# Altium schematic sheet power_sys_sch.SchDoc
size A; SheetNumber: 1; SheetTotal: 1
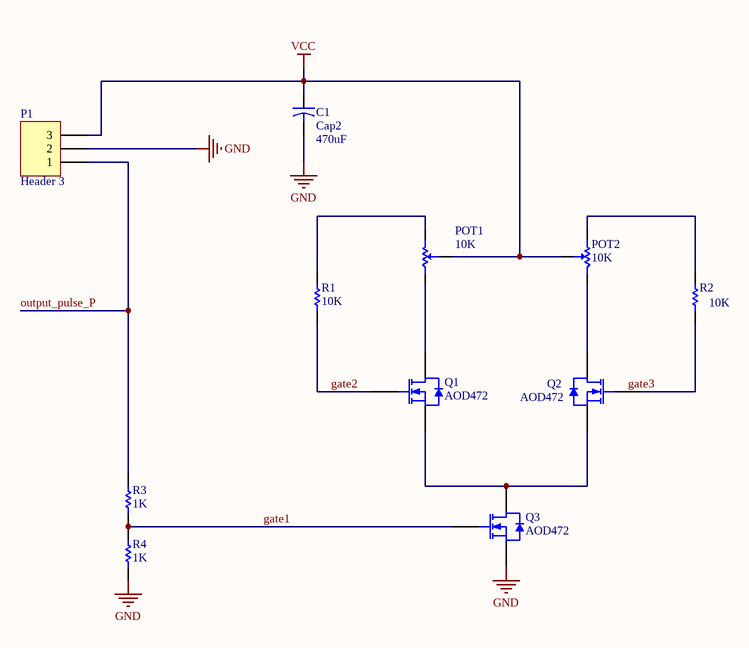
[diagram p0: power_sys_sch.SchDoc]

## Parts
C1  Cap2  value 470uF  [CAPR5-4X5]
P1  Header 3  [HDR1X3]
POT1  10K  [POT]
POT2  10K  [POT]
Q1  AOD472  [TO252-3L]
Q2  AOD472  [TO252-3L]
Q3  AOD472  [TO252-3L]
R1  10K  [RESC4817X04N]
R2  10K  [RESC4817X04N]
R3  1K  [RESC4817X04N]
R4  1K  [RESC4817X04N]

## Nets
GND: C1.2 P1.2 Q3.3(S) R4.1
VCC: C1.1 P1.3 POT1.3(SetPoint) POT2.3(SetPoint)
gate1: Q3.1(G) R3.1 R4.2
gate2: Q1.1(G) R1.1
output_pulse_P: P1.1 R3.2
NetPOT1_1: POT1.1(CCW) Q1.4(D)
NetPOT1_2: POT1.2(CW) R1.2
NetPOT2_1: POT2.1(CCW) Q2.4(D)
NetPOT2_2: POT2.2(CW) R2.2
NetQ1_3: Q1.3(S) Q2.3(S) Q3.4(D)
NetQ2_1: Q2.1(G) R2.1

## Notes on the sheet
- Labels drawn without touching a wire or pin: gate3

## Library data of the parts
C1 = Cap2: Capacitor; Published: 23-Sep-2002; PackageReference: CAPR5-4X5; Publisher: Altium Limited; PackageDescription: Capacitor; 2 Leads
P1 = Header 3: Header, 3-Pin; System: Connector; LatestRevisionDate: 17-Jul-2002; LatestRevisionNote: Re-released for DXP Platform.; Publisher: Altium Limited
POT1 POT2 = POT: Variable Resistor; Value: 10K
Q1-Q3 = AOD472: N-channel MOSFET; Note: Pin 2 is trimmed (and not drawn) and is electrically connected to Drain; Published: 2017-1-12; DatasheetVersion: 2017-1-12; PackageVersion: 2017-1-12; PackageReference: D-PAK TO-252; Publisher: Abbas Basereh; PackageDescription: D-PAK TO-252; ComponentLink1Description: Manufacturer Link; ComponentLink2Description: Datasheet; ComponentLink2URL: http://www.roboeq.ir/files/id/2912/name/aod472.pdf/
R1-R4 = RES 1206 0.25W: RES 1206; Designer: Abbas Basereh; Desc.: RES SMD 1206; Data: 16-12-2016